# Altium schematic sheet 10_FPGA_HSIO_PWR.SchDoc
size A3
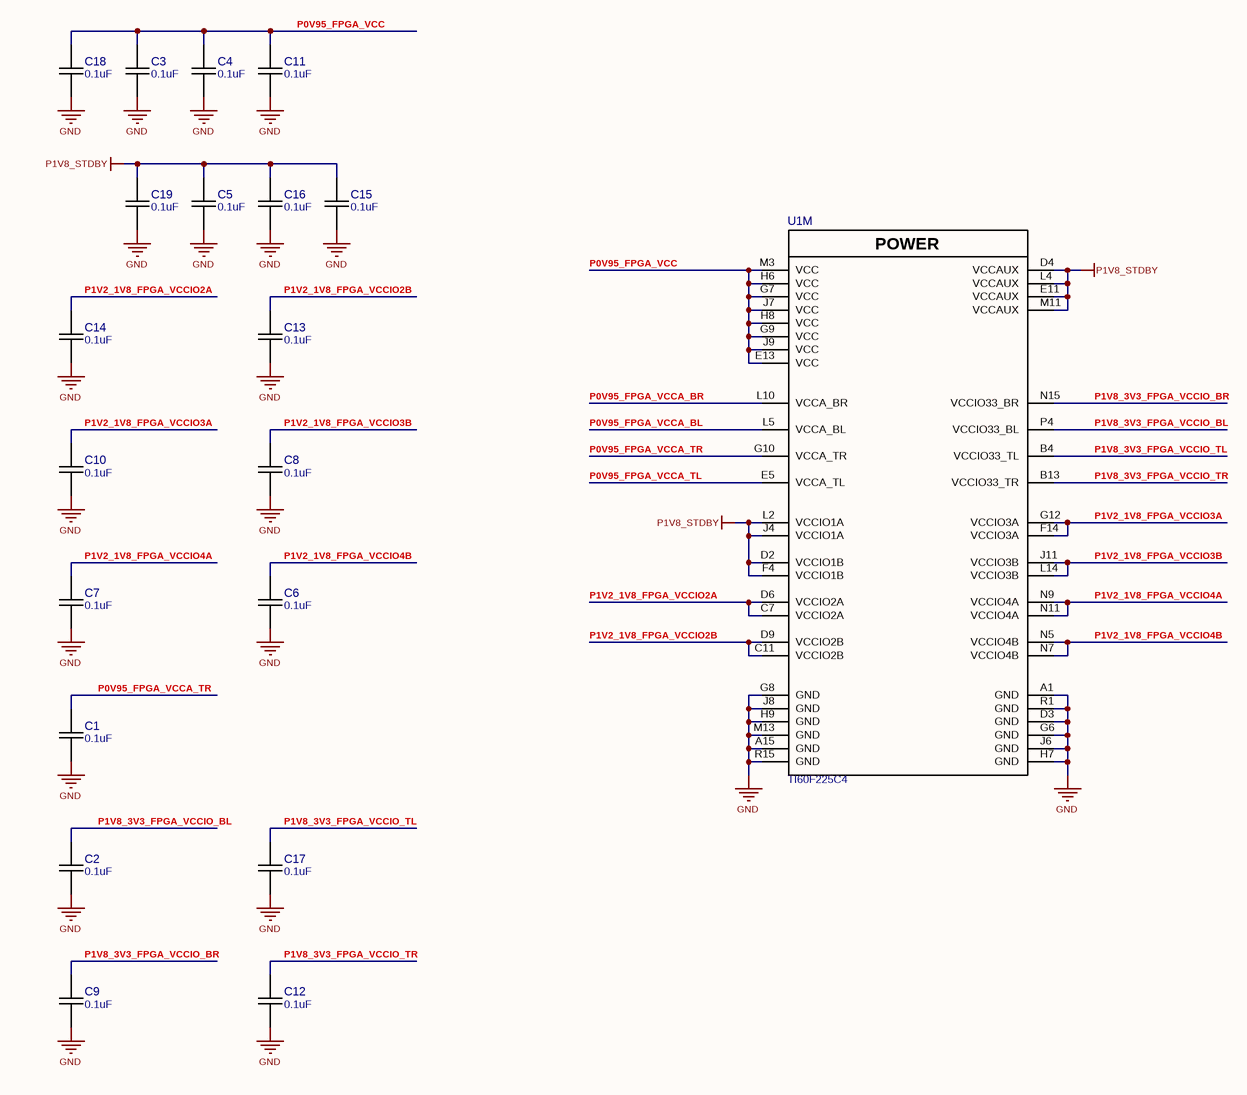
[diagram p0: 10_FPGA_HSIO_PWR.SchDoc]

## Parts
C1  0.1uF  [CAPC1005X06N]
C2  0.1uF  [CAPC1005X06N]
C3  0.1uF  [CAPC1005X06N]
C4  0.1uF  [CAPC1005X06N]
C5  0.1uF  [CAPC1005X06N]
C6  0.1uF  [CAPC1005X06N]
C7  0.1uF  [CAPC1005X06N]
C8  0.1uF  [CAPC1005X06N]
C9  0.1uF  [CAPC1005X06N]
C10  0.1uF  [CAPC1005X06N]
C11  0.1uF  [CAPC1005X06N]
C12  0.1uF  [CAPC1005X06N]
C13  0.1uF  [CAPC1005X06N]
C14  0.1uF  [CAPC1005X06N]
C15  0.1uF  [CAPC1005X06N]
C16  0.1uF  [CAPC1005X06N]
C17  0.1uF  [CAPC1005X06N]
C18  0.1uF  [CAPC1005X06N]
C19  0.1uF  [CAPC1005X06N]
U1  TI60F225C4  [BGA225C65P15X15_1000X1000X100]  (part M of 13)

## Nets
GND: C1.1 C2.1 C3.1 C4.1 C5.1 C6.1 C7.1 C8.1 C9.1 C10.1 C11.1 C12.1 C13.1 C14.1 C15.1 C16.1 C17.1 C18.1 C19.1 U1.A1(GND) U1.A15(GND) U1.D3(GND) U1.G6(GND) U1.G8(GND) U1.H7(GND) U1.H9(GND) U1.J6(GND) U1.J8(GND) U1.M13(GND) U1.R1(GND) U1.R15(GND)
P1V8_STDBY: C5.2 C15.2 C16.2 C19.2 U1.D2(VCCIO1B) U1.D4(VCCAUX) U1.E11(VCCAUX) U1.F4(VCCIO1B) U1.J4(VCCIO1A) U1.L2(VCCIO1A) U1.L4(VCCAUX) U1.M11(VCCAUX)
P0V95_FPGA_VCC: C3.2 C4.2 C11.2 C18.2 U1.E13(VCC) U1.G7(VCC) U1.G9(VCC) U1.H6(VCC) U1.H8(VCC) U1.J7(VCC) U1.J9(VCC) U1.M3(VCC)
P0V95_FPGA_VCCA_BL: U1.L5(VCCA_BL)
P0V95_FPGA_VCCA_BR: U1.L10(VCCA_BR)
P0V95_FPGA_VCCA_TL: U1.E5(VCCA_TL)
P0V95_FPGA_VCCA_TR: C1.2 U1.G10(VCCA_TR)
P1V2_1V8_FPGA_VCCIO2A: C14.2 U1.C7(VCCIO2A) U1.D6(VCCIO2A)
P1V2_1V8_FPGA_VCCIO2B: C13.2 U1.C11(VCCIO2B) U1.D9(VCCIO2B)
P1V2_1V8_FPGA_VCCIO3A: C10.2 U1.F14(VCCIO3A) U1.G12(VCCIO3A)
P1V2_1V8_FPGA_VCCIO3B: C8.2 U1.J11(VCCIO3B) U1.L14(VCCIO3B)
P1V2_1V8_FPGA_VCCIO4A: C7.2 U1.N9(VCCIO4A) U1.N11(VCCIO4A)
P1V2_1V8_FPGA_VCCIO4B: C6.2 U1.N5(VCCIO4B) U1.N7(VCCIO4B)
P1V8_3V3_FPGA_VCCIO_BL: C2.2 U1.P4(VCCIO33_BL)
P1V8_3V3_FPGA_VCCIO_BR: C9.2 U1.N15(VCCIO33_BR)
P1V8_3V3_FPGA_VCCIO_TL: C17.2 U1.B4(VCCIO33_TL)
P1V8_3V3_FPGA_VCCIO_TR: C12.2 U1.B13(VCCIO33_TR)

## Notes on the sheet
- (in symbol TI60F225C4, part M) POWER

## Library data of the parts
C1-C19 = GRM155R71E104KE14J: CAP CER 0.1UF 25V X7R 0402; Manufacturer 1: Murata Electronics; Tol: 10%; Part Number: GRM155R71E104KE14J; Value: 0.1uF; Voltage: 25V; TempC: X7R; Manufacturer Part Number 1: GRM155R71E104KE14J; Supplier 1: Digi-Key; Supplier Part Number 1: 490-14603-1-ND
U1 = TI60F225C4: FPGA TITAN 140HSIO 4PLL 225BGA; Manufacturer 1: Efinix, Inc.; Part Number: TI60F225C4; Manufacturer Part Number 1: TI60F225C4; Supplier 1: Digi-Key; Supplier Part Number 1: 2134-TI60F225C4-ND